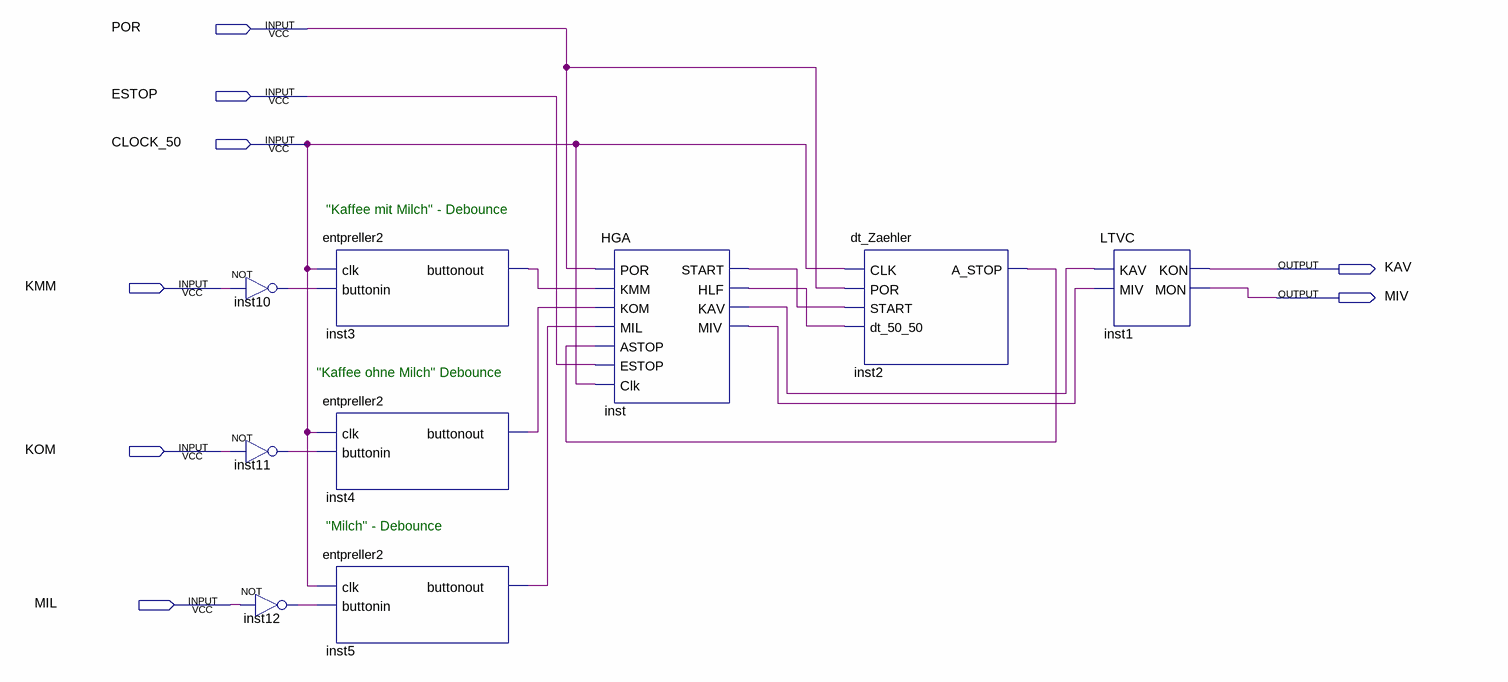
[diagram p0: schematic sheet]
// Quartus schematic Top.bdf as structural Verilog: 9 symbols, 8 pins
module Top (
  input  POR,
  input  ESTOP,
  input  CLOCK_50,
  input  KMM,
  input  KOM,
  input  MIL,
  output KAV,
  output MIV
);

  wire inst2_a_stop, inst3_buttonout, inst4_buttonout, inst5_buttonout, inst10_out, inst11_out, inst12_out,
       inst_hlf, inst_kav, inst_miv, inst_start;

  not inst10 (inst10_out, KMM);
  not inst11 (inst11_out, KOM);
  not inst12 (inst12_out, MIL);
  entpreller2 inst3 (.clk(CLOCK_50), .buttonin(inst10_out), .buttonout(inst3_buttonout));
  entpreller2 inst4 (.clk(CLOCK_50), .buttonin(inst11_out), .buttonout(inst4_buttonout));
  entpreller2 inst5 (.clk(CLOCK_50), .buttonin(inst12_out), .buttonout(inst5_buttonout));
  HGA inst (
    .POR(POR), .KMM(inst3_buttonout), .KOM(inst4_buttonout), .MIL(inst5_buttonout), .ASTOP(inst2_a_stop),
    .ESTOP(ESTOP), .Clk(CLOCK_50), .START(inst_start), .HLF(inst_hlf), .KAV(inst_kav), .MIV(inst_miv));
  dt_Zaehler inst2 (.CLK(CLOCK_50), .POR(POR), .START(inst_start), .dt_50_50(inst_hlf), .A_STOP(inst2_a_stop));
  LTVC inst1 (.KAV(inst_kav), .MIV(inst_miv), .KON(KAV), .MON(MIV));

  // Notes on the sheet:
  //   "Kaffee mit Milch" - Debounce
  //   "Kaffee ohne Milch" Debounce
  //   "Milch" - Debounce
endmodule
